# Altium project BP_LCD_Panel_v1.PrjPcb
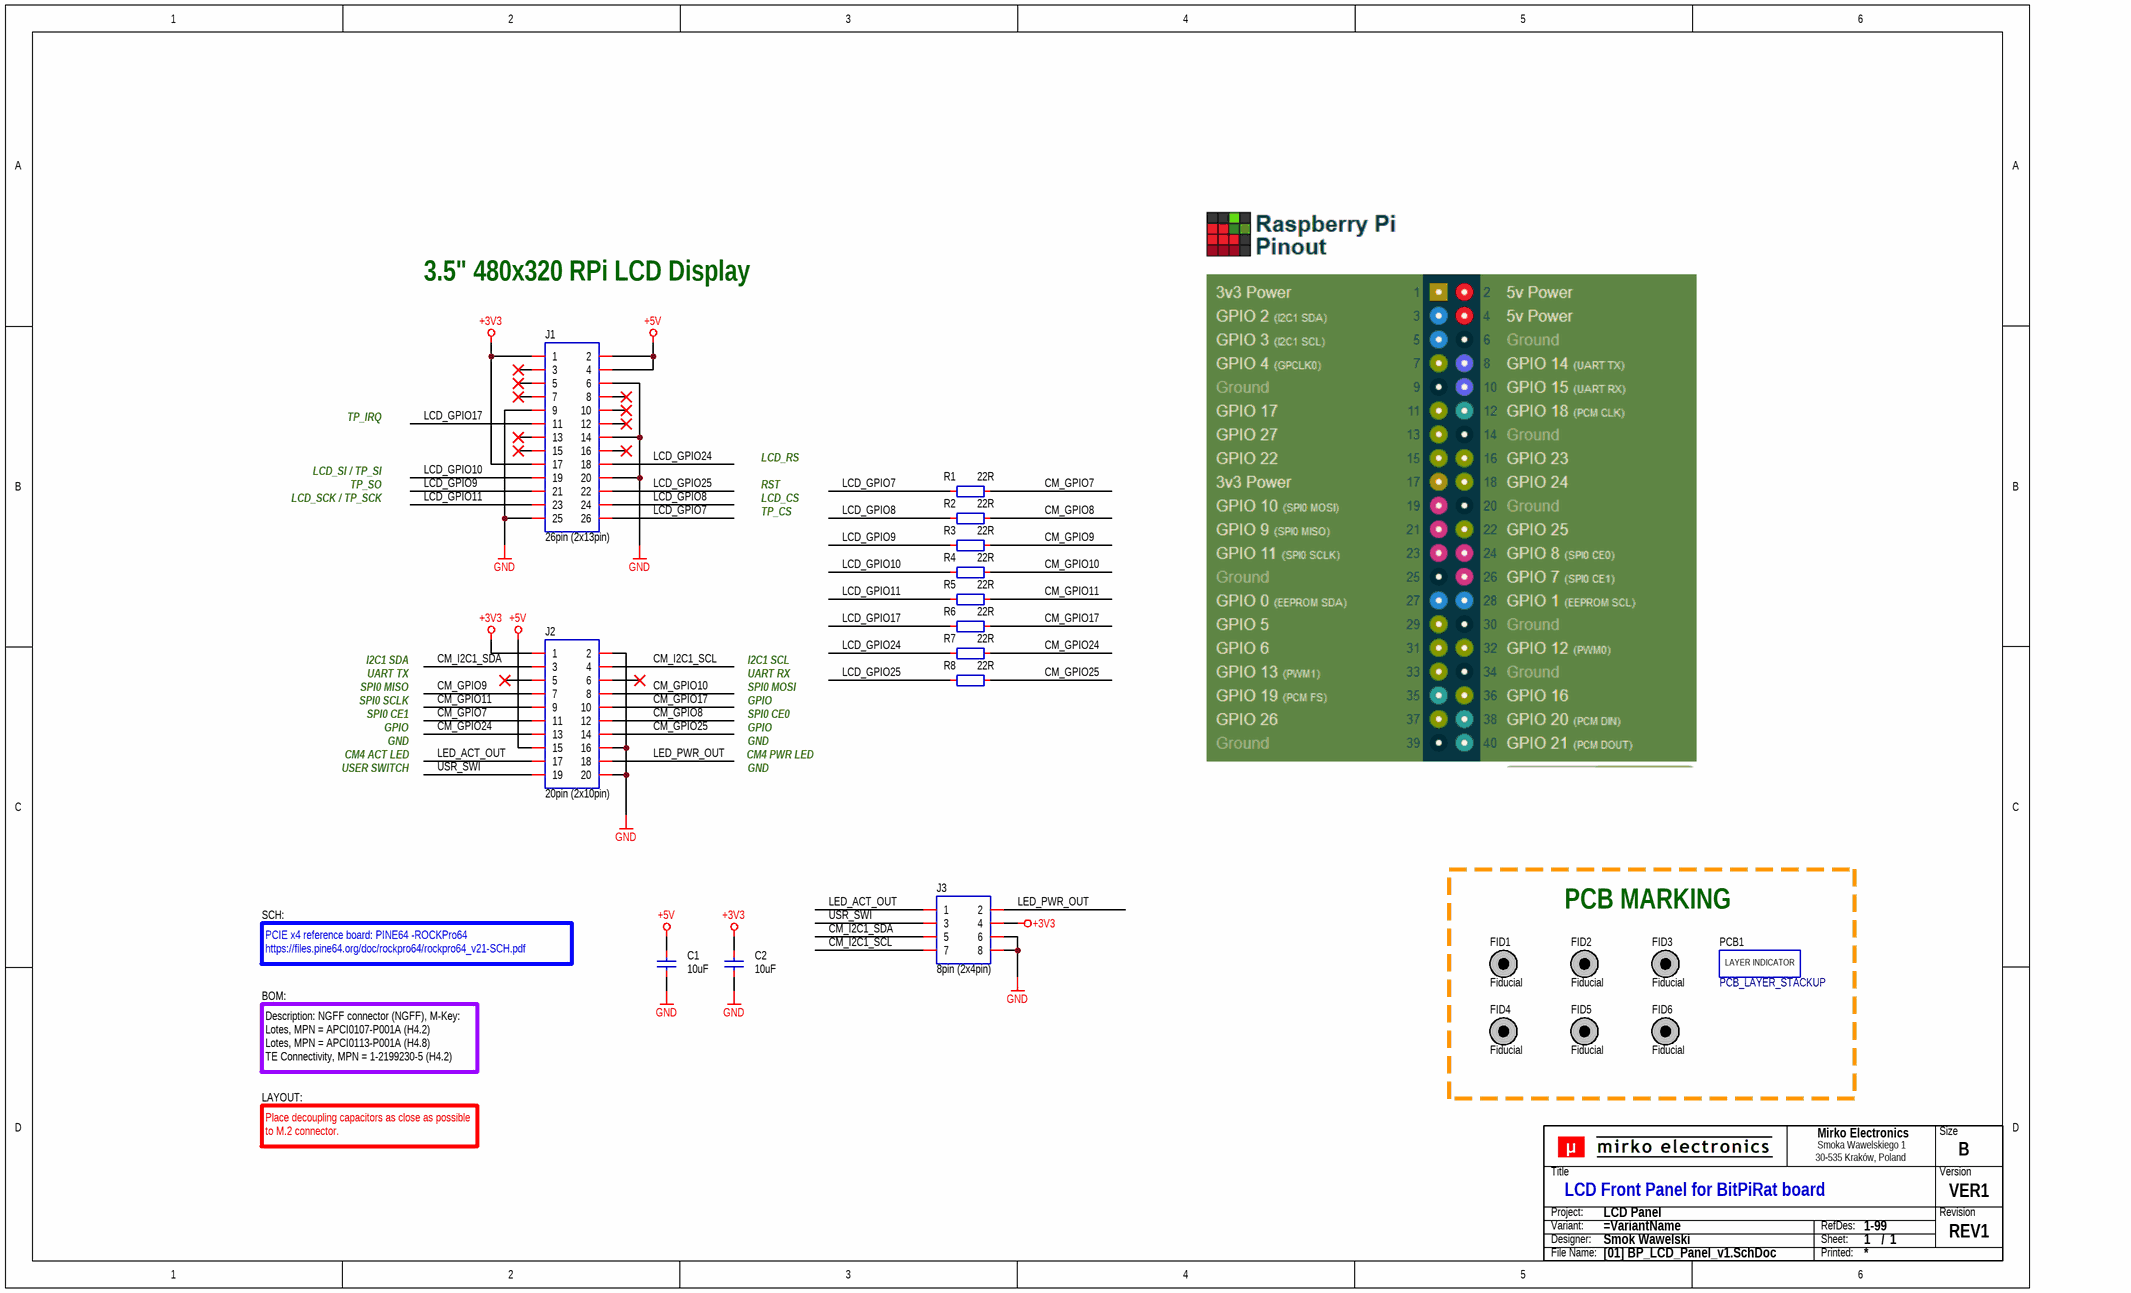
[diagram p0: [01] BP_LCD_Panel_v1.SchDoc]
GlobalProjectName: LCD Panel for BitPiRat; PCBProjectName: LCD Panel; SchPcbReleaseState: DRAFT; SchPcbRevision: REV1; SchPcbVersion: VER1
1 sheet, 21 parts. Net scope: global (net labels, ports and power ports of the same name join across sheets).
Board file: BP_LCD_Panel_v1.PcbDoc

## Sheet [01] BP_LCD_Panel_v1.SchDoc: LCD Front Panel for BitPiRat board
size B; Engineer: Smok Wawelski; DocumentNumber: 1; SheetNumber: 1; SheetTotal: 1; PageSize: B; Designators: 1-99

### Parts
C1  10uF  [CAP_0603_R]
C2  10uF  [CAP_0603_R]
FID1  Fiducial  [PCB_FID_RND_100x300]  (no BOM)
FID2  Fiducial  [PCB_FID_RND_100x300]  (no BOM)
FID3  Fiducial  [PCB_FID_RND_100x300]  (no BOM)
FID4  Fiducial  [PCB_FID_RND_100x300]  (no BOM)
FID5  Fiducial  [PCB_FID_RND_100x300]  (no BOM)
FID6  Fiducial  [PCB_FID_RND_100x300]  (no BOM)
J1  26pin (2x13pin)  [CON_HDR_P254_2X13_STR_SMD_R]
J2  20pin (2x10pin)  [CON_IDC_SMD_P254_2X10]
J3  8pin (2x4pin)  [CON_IDC_SMD_P254_2X04]
PCB1  PCB_LAYER_STACKUP  [PCB_STACKUP-2L_A1]  (no BOM)
R1  22R  [RES_0603_R]
R2  22R  [RES_0603_R]
R3  22R  [RES_0603_R]
R4  22R  [RES_0603_R]
R5  22R  [RES_0603_R]
R6  22R  [RES_0603_R]
R7  22R  [RES_0603_R]
R8  22R  [RES_0603_R]
TB?  Title block  (value not drawn)  (graphical)

### Nets
+3V3: C2.2 J1.1 J1.17 J2.1 J3.4
+5V: C1.2 J1.2 J1.4 J2.15
GND: C1.1 C2.1 J1.6 J1.9 J1.14 J1.20 J1.25 J2.2 J2.16 J2.20 J3.6 J3.8
CM_GPIO7: J2.11 R1.2
CM_GPIO8: J2.12 R2.2
CM_GPIO9: J2.7 R3.2
CM_GPIO10: J2.8 R4.2
CM_GPIO11: J2.9 R5.2
CM_GPIO17: J2.10 R6.2
CM_GPIO24: J2.13 R7.2
CM_GPIO25: J2.14 R8.2
CM_I2C1_SCL: J2.4 J3.7
CM_I2C1_SDA: J2.3 J3.5
LCD_GPIO7: J1.26 R1.1
LCD_GPIO8: J1.24 R2.1
LCD_GPIO9: J1.21 R3.1
LCD_GPIO10: J1.19 R4.1
LCD_GPIO11: J1.23 R5.1
LCD_GPIO17: J1.11 R6.1
LCD_GPIO24: J1.18 R7.1
LCD_GPIO25: J1.22 R8.1
LED_ACT_OUT: J2.17 J3.1
LED_PWR_OUT: J2.18 J3.2
USR_SWI: J2.19 J3.3

Not connected (* = marked no-connect by the designer): J1 3* 5* 7* 8* 10* 12* 13* 15* 16*; J2 5* 6*

### Notes on the sheet
- 3.5" 480x320 RPi LCD Display
- TP_IRQ
- LCD_SI / TP_SI
- TP_SO
- LCD_SCK / TP_SCK
- LCD_RS
- RST
- LCD_CS
- TP_CS
- I2C1 SDA
- UART TX
- SPI0 MISO
- SPI0 SCLK
- I2C1 SCL
- UART RX
- SPI0 MOSI
- GPIO
- SPI0 CE1
- CM4 ACT LED
- USER SWITCH
- GND
- SPI0 CE0
- CM4 PWR LED
- PCB MARKING
- PCIE x4 reference board: PINE64 -ROCKPro64
  https://files.pine64.org/doc/rockpro64/rockpro64_v21-SCH.pdf
- SCH:
- BOM:
- Description: NGFF connector (NGFF), M-Key:
  Lotes, MPN = APCI0107-P001A (H4.2)
  Lotes, MPN = APCI0113-P001A (H4.8)
  TE Connectivity, MPN = 1-2199230-5 (H4.2)
- LAYOUT:
- Place decoupling capacitors as close as possible to M.2 connector.
- (in symbol PCB_LAYER_STACKUP) LAYER INDICATOR
- (in symbol SCH_TITLE_BLOCK_V1) Mirko Electronics; Size; Smoka Wawelskiego 1; 30-535 Kraków, Poland; Title; Version; Project:; Revision; Variant:; RefDes:; Designer:; Sheet:; /; File Name:; Printed:

### Library data of the parts
C1 C2 = CAP-0023: Capacitor; MLCC; GENERIC; TBD; TBD; TBD; TBD; SMD; 0603 (1608);; Component Type: Capacitor; Component Subtype: MLCC; Value: 10uF; Manufacturer: GENERIC; MPN: GENERIC; Mounting Type: SMD; Package (Case): 0603 (1608); Supplier: ?
FID1-FID6 = PCB_FID_RND: PCB Marking; Fiducial; Round;; Value: Fiducial; Component Subtype: -; Component Type: Fiducial; Mounting Type: -; Supplier: ?
J1 = CON_2X13_ROW: Connector; 2 Row;; Manufacturer: GENERIC; Component Subtype: Pin Header; Package (Case): THT; Value: 26pin (2x13pin); Component Type: Connector; Mounting Type: THT; MPN: GENERIC; Supplier: ?
J2 = CON_2X10_ROW: Connector; 2 Row;; Manufacturer: GENERIC; Component Subtype: Pin Header; Package (Case): THT; Component Type: Connector; Mounting Type: THT; MPN: GENERIC; Supplier: ?; Value: 20pin (2x10pin)
J3 = CON_2X04_ROW: Connector; 2 Row;; Manufacturer: GENERIC; Component Subtype: Pin Header; Package (Case): THT; Component Type: Connector; Mounting Type: THT; MPN: GENERIC; Supplier: ?; Value: 8pin (2x4pin)
R1-R8 = RES-0030: Resistor; Thick Film; 22R; 1%; 100mW; 100PPM; 75V; Standard; SMD; 0603 (1608);; Manufacturer: Yageo Corporation; MPN: TBD; Component Body: 1.60 x 0.80mm; Packaging Type: Tape & Reel; ID: RES-0030; Component Type: Resistor; Component Subtype: Thick Film; Value: 22R; Mounting Type: SMD; Package (Case): 0603 (1608); Component Height: 0.45mm; ROHS Status: RoHS Compliant; Operating Temperature: -55°C to +155°C; Resistance: 22R; Tolerance: 1%; Power Rating: 100mW; TCR: 100PPM; Voltage Rating: 75V; Features: Standard
TB? = SCH_TITLE_BLOCK_V1: Component Type: Title block; Manufacturer: -; Mounting Type: Non component; MPN: -; Operating Temperature: -; Package: -; Specification: Title block; Value: Title block; Replacement: -; System: ?
PCB1 = PCB_LAYER_STACKUP: Component Subtype: -; Component Type: PCB Marking; Mounting Type: -; Supplier: ?